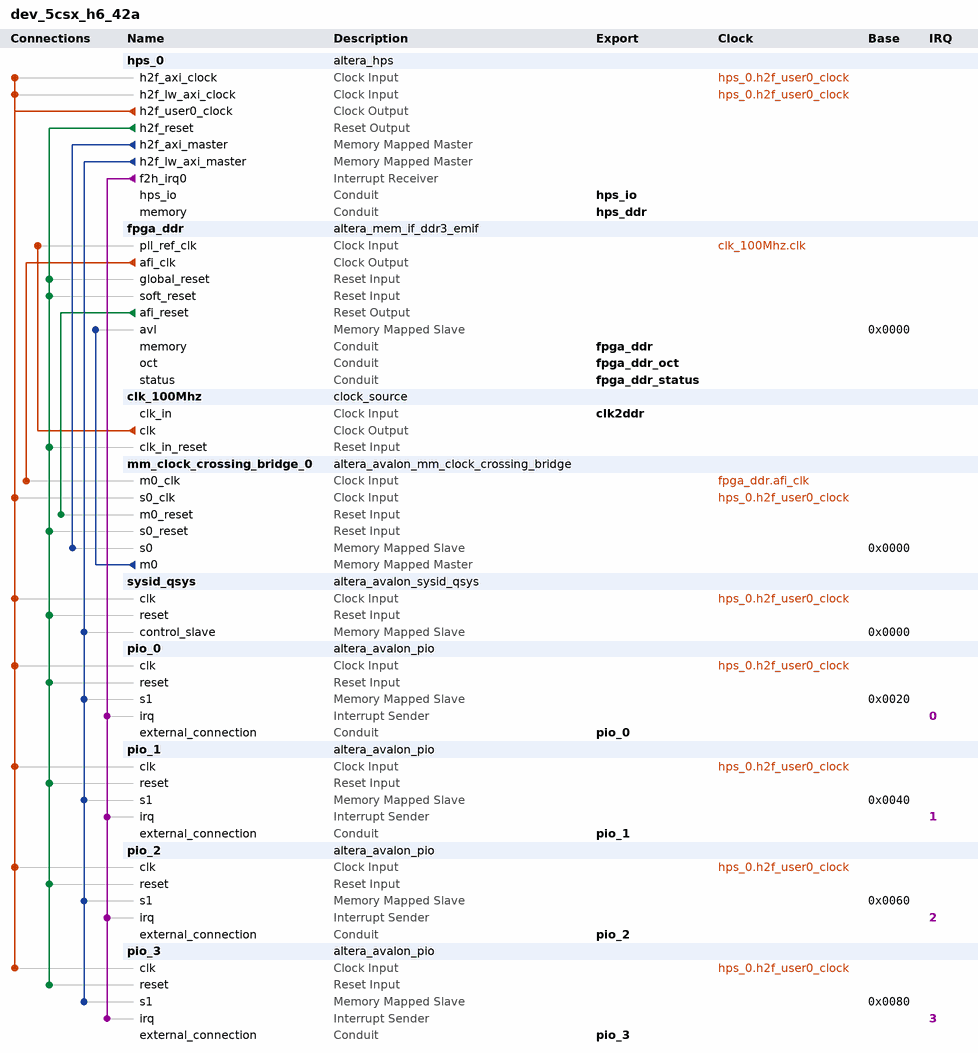
[diagram p0: system contents]
# Platform Designer (Qsys) system dev_5csx_h6_42a, Cyclone V 5CSXFC6C6U23C7
# Parameters at their usual value, and those the tool derives, are not listed.
package require -exact qsys 14.1
create_system dev_5csx_h6_42a
set_project_property DEVICE_FAMILY {Cyclone V}
set_project_property DEVICE 5CSXFC6C6U23C7

add_instance hps_0 altera_hps 14.1
set_instance_parameter_value hps_0 CAN0_Mode CAN
set_instance_parameter_value hps_0 CAN0_PinMuxing {HPS I/O Set 0}
set_instance_parameter_value hps_0 CAN1_Mode CAN
set_instance_parameter_value hps_0 CAN1_PinMuxing {HPS I/O Set 1}
set_instance_parameter_value hps_0 EMAC1_Mode RGMII
set_instance_parameter_value hps_0 EMAC1_PinMuxing {HPS I/O Set 0}
set_instance_parameter_value hps_0 F2SCLK_COLDRST_Enable false
set_instance_parameter_value hps_0 F2SCLK_DBGRST_Enable false
set_instance_parameter_value hps_0 F2SCLK_WARMRST_Enable false
set_instance_parameter_value hps_0 F2SINTERRUPT_Enable true
set_instance_parameter_value hps_0 F2S_Width 0
set_instance_parameter_value hps_0 FPGA_PERIPHERAL_OUTPUT_CLOCK_FREQ_EMAC0_GTX_CLK 100
set_instance_parameter_value hps_0 FPGA_PERIPHERAL_OUTPUT_CLOCK_FREQ_EMAC0_MD_CLK 100
set_instance_parameter_value hps_0 FPGA_PERIPHERAL_OUTPUT_CLOCK_FREQ_EMAC1_GTX_CLK 100
set_instance_parameter_value hps_0 FPGA_PERIPHERAL_OUTPUT_CLOCK_FREQ_EMAC1_MD_CLK 100
set_instance_parameter_value hps_0 HPS_PROTOCOL DDR3
set_instance_parameter_value hps_0 I2C0_Mode I2C
set_instance_parameter_value hps_0 I2C0_PinMuxing {HPS I/O Set 1}
set_instance_parameter_value hps_0 I2C1_Mode I2C
set_instance_parameter_value hps_0 I2C1_PinMuxing {HPS I/O Set 0}
set_instance_parameter_value hps_0 LWH2F_Enable true
set_instance_parameter_value hps_0 MEM_BANKADDR_WIDTH 3
set_instance_parameter_value hps_0 MEM_CLK_FREQ 400.0
set_instance_parameter_value hps_0 MEM_COL_ADDR_WIDTH 10
set_instance_parameter_value hps_0 MEM_DQ_WIDTH 40
set_instance_parameter_value hps_0 MEM_DRV_STR RZQ/7
set_instance_parameter_value hps_0 MEM_ROW_ADDR_WIDTH 15
set_instance_parameter_value hps_0 MEM_RTT_NOM RZQ/4
set_instance_parameter_value hps_0 MEM_RTT_WR {Dynamic ODT off}
set_instance_parameter_value hps_0 MEM_TCL 7
set_instance_parameter_value hps_0 MEM_TFAW_NS 30.0
set_instance_parameter_value hps_0 MEM_TRAS_NS 35.0
set_instance_parameter_value hps_0 MEM_TRCD_NS 13.75
set_instance_parameter_value hps_0 MEM_TRFC_NS 260.0
set_instance_parameter_value hps_0 MEM_TRP_NS 13.75
set_instance_parameter_value hps_0 MEM_TRRD_NS 10.0
set_instance_parameter_value hps_0 MEM_TRTP_NS 10.0
set_instance_parameter_value hps_0 MEM_VENDOR JEDEC
set_instance_parameter_value hps_0 MEM_VOLTAGE {1.35V DDR3L}
set_instance_parameter_value hps_0 MEM_WTCL 6
set_instance_parameter_value hps_0 QSPI_Mode {2 SS}
set_instance_parameter_value hps_0 QSPI_PinMuxing {HPS I/O Set 1}
set_instance_parameter_value hps_0 REF_CLK_FREQ 25.0
set_instance_parameter_value hps_0 S2FCLK_USER0CLK_Enable true
set_instance_parameter_value hps_0 S2F_Width 1
set_instance_parameter_value hps_0 SDIO_Mode {4-bit Data}
set_instance_parameter_value hps_0 SDIO_PinMuxing {HPS I/O Set 0}
set_instance_parameter_value hps_0 SPIM1_Mode N/A
set_instance_parameter_value hps_0 SPIM1_PinMuxing Unused
set_instance_parameter_value hps_0 STM_Enable false
set_instance_parameter_value hps_0 TIMING_BOARD_AC_SKEW 0.0
set_instance_parameter_value hps_0 TIMING_BOARD_AC_TO_CK_SKEW 0.0
set_instance_parameter_value hps_0 TIMING_BOARD_DQ_TO_DQS_SKEW 0.0
set_instance_parameter_value hps_0 TIMING_BOARD_MAX_CK_DELAY 0.6
set_instance_parameter_value hps_0 TIMING_BOARD_MAX_DQS_DELAY 0.2
set_instance_parameter_value hps_0 TIMING_BOARD_SKEW_BETWEEN_DQS 0.01
set_instance_parameter_value hps_0 TIMING_BOARD_SKEW_CKDQS_DIMM_MAX 0.215
set_instance_parameter_value hps_0 TIMING_BOARD_SKEW_CKDQS_DIMM_MIN 0.092
set_instance_parameter_value hps_0 TIMING_BOARD_SKEW_WITHIN_DQS 0.0
set_instance_parameter_value hps_0 TIMING_TDH 45
set_instance_parameter_value hps_0 TIMING_TDQSCK 225
set_instance_parameter_value hps_0 TIMING_TDQSQ 100
set_instance_parameter_value hps_0 TIMING_TDQSS 0.27
set_instance_parameter_value hps_0 TIMING_TDS 10
set_instance_parameter_value hps_0 TIMING_TDSH 0.18
set_instance_parameter_value hps_0 TIMING_TDSS 0.18
set_instance_parameter_value hps_0 TIMING_TIH 120
set_instance_parameter_value hps_0 TIMING_TIS 170
set_instance_parameter_value hps_0 TIMING_TQSH 0.4
set_instance_parameter_value hps_0 UART0_Mode {No Flow Control}
set_instance_parameter_value hps_0 UART0_PinMuxing {HPS I/O Set 2}
set_instance_parameter_value hps_0 USB1_Mode SDR
set_instance_parameter_value hps_0 USB1_PinMuxing {HPS I/O Set 0}
set_instance_parameter_value hps_0 desired_cfg_clk_mhz 100.0
set_instance_parameter_value hps_0 desired_qspi_clk_mhz 400.0

add_instance fpga_ddr altera_mem_if_ddr3_emif 14.1
set_instance_parameter_value fpga_ddr AVL_MAX_SIZE 4
set_instance_parameter_value fpga_ddr BYTE_ENABLE false
set_instance_parameter_value fpga_ddr CALIBRATION_MODE Skip
set_instance_parameter_value fpga_ddr CORE_DEBUG_CONNECTION INTERNAL_JTAG
set_instance_parameter_value fpga_ddr CPORT_TYPE_PORT Bidirectional,Bidirectional,Bidirectional,Bidirectional,Bidirectional,Bidirectional
set_instance_parameter_value fpga_ddr EXPORT_AFI_HALF_CLK false
set_instance_parameter_value fpga_ddr HARD_EMIF false
set_instance_parameter_value fpga_ddr MEM_BANKADDR_WIDTH 3
set_instance_parameter_value fpga_ddr MEM_CLK_FREQ 300.0
set_instance_parameter_value fpga_ddr MEM_CLK_FREQ_MAX 800.0
set_instance_parameter_value fpga_ddr MEM_COL_ADDR_WIDTH 10
set_instance_parameter_value fpga_ddr MEM_DQ_WIDTH 8
set_instance_parameter_value fpga_ddr MEM_DRV_STR RZQ/6
set_instance_parameter_value fpga_ddr MEM_FORMAT DISCRETE
set_instance_parameter_value fpga_ddr MEM_ROW_ADDR_WIDTH 15
set_instance_parameter_value fpga_ddr MEM_RTT_NOM {ODT Disabled}
set_instance_parameter_value fpga_ddr MEM_TCL 7
set_instance_parameter_value fpga_ddr MEM_TFAW_NS 30.0
set_instance_parameter_value fpga_ddr MEM_TRAS_NS 35.0
set_instance_parameter_value fpga_ddr MEM_TRCD_NS 13.75
set_instance_parameter_value fpga_ddr MEM_TRFC_NS 260.0
set_instance_parameter_value fpga_ddr MEM_TRP_NS 13.75
set_instance_parameter_value fpga_ddr MEM_TRRD_NS 10.0
set_instance_parameter_value fpga_ddr MEM_TRTP_NS 10.0
set_instance_parameter_value fpga_ddr MEM_TWTR 4
set_instance_parameter_value fpga_ddr MEM_VENDOR JEDEC
set_instance_parameter_value fpga_ddr MEM_VOLTAGE {1.35V DDR3L}
set_instance_parameter_value fpga_ddr MEM_WTCL 6
set_instance_parameter_value fpga_ddr PLL_LOCATION Top_Bottom
set_instance_parameter_value fpga_ddr POWER_OF_TWO_BUS false
set_instance_parameter_value fpga_ddr PRIORITY_PORT 1,1,1,1,1,1
set_instance_parameter_value fpga_ddr RATE Half
set_instance_parameter_value fpga_ddr REF_CLK_FREQ 100.0
set_instance_parameter_value fpga_ddr SPEED_GRADE 7
set_instance_parameter_value fpga_ddr TIMING_BOARD_AC_SKEW 0.0186
set_instance_parameter_value fpga_ddr TIMING_BOARD_AC_TO_CK_SKEW -0.02
set_instance_parameter_value fpga_ddr TIMING_BOARD_DQ_TO_DQS_SKEW 0.001
set_instance_parameter_value fpga_ddr TIMING_BOARD_MAX_CK_DELAY 0.237
set_instance_parameter_value fpga_ddr TIMING_BOARD_MAX_DQS_DELAY 0.071
set_instance_parameter_value fpga_ddr TIMING_BOARD_SKEW_BETWEEN_DQS 0.001
set_instance_parameter_value fpga_ddr TIMING_BOARD_SKEW_CKDQS_DIMM_MAX 0.167
set_instance_parameter_value fpga_ddr TIMING_BOARD_SKEW_CKDQS_DIMM_MIN 0.167
set_instance_parameter_value fpga_ddr TIMING_BOARD_SKEW_WITHIN_DQS 0.001
set_instance_parameter_value fpga_ddr TIMING_TDH 45
set_instance_parameter_value fpga_ddr TIMING_TDQSCK 255
set_instance_parameter_value fpga_ddr TIMING_TDQSQ 100
set_instance_parameter_value fpga_ddr TIMING_TDQSS 0.27
set_instance_parameter_value fpga_ddr TIMING_TDS 10
set_instance_parameter_value fpga_ddr TIMING_TDSH 0.18
set_instance_parameter_value fpga_ddr TIMING_TDSS 0.18
set_instance_parameter_value fpga_ddr TIMING_TIH 120
set_instance_parameter_value fpga_ddr TIMING_TIS 170
set_instance_parameter_value fpga_ddr TIMING_TQSH 0.4
set_instance_parameter_value fpga_ddr USER_DEBUG_LEVEL 1

add_instance clk_100Mhz clock_source 14.1
set_instance_parameter_value clk_100Mhz clockFrequency 100000000

add_instance mm_clock_crossing_bridge_0 altera_avalon_mm_clock_crossing_bridge 14.1
set_instance_parameter_value mm_clock_crossing_bridge_0 ADDRESS_WIDTH 28
set_instance_parameter_value mm_clock_crossing_bridge_0 COMMAND_FIFO_DEPTH 512
set_instance_parameter_value mm_clock_crossing_bridge_0 DATA_WIDTH 32
set_instance_parameter_value mm_clock_crossing_bridge_0 MASTER_SYNC_DEPTH 4
set_instance_parameter_value mm_clock_crossing_bridge_0 MAX_BURST_SIZE 1
set_instance_parameter_value mm_clock_crossing_bridge_0 RESPONSE_FIFO_DEPTH 512
set_instance_parameter_value mm_clock_crossing_bridge_0 SLAVE_SYNC_DEPTH 4
set_instance_parameter_value mm_clock_crossing_bridge_0 USE_AUTO_ADDRESS_WIDTH 0

add_instance sysid_qsys altera_avalon_sysid_qsys 14.1
set_instance_parameter_value sysid_qsys id 1

add_instance pio_0 altera_avalon_pio 14.1
set_instance_parameter_value pio_0 bitClearingEdgeCapReg true
set_instance_parameter_value pio_0 bitModifyingOutReg true
set_instance_parameter_value pio_0 captureEdge true
set_instance_parameter_value pio_0 direction Bidir
set_instance_parameter_value pio_0 generateIRQ true
set_instance_parameter_value pio_0 irqType EDGE
set_instance_parameter_value pio_0 width 32

add_instance pio_1 altera_avalon_pio 14.1
set_instance_parameter_value pio_1 bitClearingEdgeCapReg true
set_instance_parameter_value pio_1 bitModifyingOutReg true
set_instance_parameter_value pio_1 captureEdge true
set_instance_parameter_value pio_1 direction Bidir
set_instance_parameter_value pio_1 generateIRQ true
set_instance_parameter_value pio_1 irqType EDGE
set_instance_parameter_value pio_1 width 32

add_instance pio_2 altera_avalon_pio 14.1
set_instance_parameter_value pio_2 bitClearingEdgeCapReg true
set_instance_parameter_value pio_2 bitModifyingOutReg true
set_instance_parameter_value pio_2 captureEdge true
set_instance_parameter_value pio_2 direction Bidir
set_instance_parameter_value pio_2 generateIRQ true
set_instance_parameter_value pio_2 irqType EDGE
set_instance_parameter_value pio_2 width 32

add_instance pio_3 altera_avalon_pio 14.1
set_instance_parameter_value pio_3 bitClearingEdgeCapReg true
set_instance_parameter_value pio_3 bitModifyingOutReg true
set_instance_parameter_value pio_3 captureEdge true
set_instance_parameter_value pio_3 direction Bidir
set_instance_parameter_value pio_3 generateIRQ true
set_instance_parameter_value pio_3 irqType EDGE
set_instance_parameter_value pio_3 width 3

# connections
add_connection clk_100Mhz.clk fpga_ddr.pll_ref_clk clock
add_connection fpga_ddr.afi_clk mm_clock_crossing_bridge_0.m0_clk clock
add_connection hps_0.h2f_user0_clock hps_0.h2f_axi_clock clock
add_connection hps_0.h2f_user0_clock hps_0.h2f_lw_axi_clock clock
add_connection hps_0.h2f_user0_clock mm_clock_crossing_bridge_0.s0_clk clock
add_connection hps_0.h2f_user0_clock pio_0.clk clock
add_connection hps_0.h2f_user0_clock pio_1.clk clock
add_connection hps_0.h2f_user0_clock pio_2.clk clock
add_connection hps_0.h2f_user0_clock pio_3.clk clock
add_connection hps_0.h2f_user0_clock sysid_qsys.clk clock
add_connection fpga_ddr.afi_reset mm_clock_crossing_bridge_0.m0_reset reset
add_connection hps_0.h2f_reset clk_100Mhz.clk_in_reset reset
add_connection hps_0.h2f_reset fpga_ddr.global_reset reset
add_connection hps_0.h2f_reset fpga_ddr.soft_reset reset
add_connection hps_0.h2f_reset mm_clock_crossing_bridge_0.s0_reset reset
add_connection hps_0.h2f_reset pio_0.reset reset
add_connection hps_0.h2f_reset pio_1.reset reset
add_connection hps_0.h2f_reset pio_2.reset reset
add_connection hps_0.h2f_reset pio_3.reset reset
add_connection hps_0.h2f_reset sysid_qsys.reset reset
add_connection hps_0.h2f_axi_master mm_clock_crossing_bridge_0.s0 avalon
set_connection_parameter_value hps_0.h2f_axi_master/mm_clock_crossing_bridge_0.s0 baseAddress 0x0000
add_connection hps_0.h2f_lw_axi_master pio_0.s1 avalon
set_connection_parameter_value hps_0.h2f_lw_axi_master/pio_0.s1 baseAddress 0x0020
add_connection hps_0.h2f_lw_axi_master pio_1.s1 avalon
set_connection_parameter_value hps_0.h2f_lw_axi_master/pio_1.s1 baseAddress 0x0040
add_connection hps_0.h2f_lw_axi_master pio_2.s1 avalon
set_connection_parameter_value hps_0.h2f_lw_axi_master/pio_2.s1 baseAddress 0x0060
add_connection hps_0.h2f_lw_axi_master pio_3.s1 avalon
set_connection_parameter_value hps_0.h2f_lw_axi_master/pio_3.s1 baseAddress 0x0080
add_connection hps_0.h2f_lw_axi_master sysid_qsys.control_slave avalon
set_connection_parameter_value hps_0.h2f_lw_axi_master/sysid_qsys.control_slave baseAddress 0x0000
add_connection mm_clock_crossing_bridge_0.m0 fpga_ddr.avl avalon
set_connection_parameter_value mm_clock_crossing_bridge_0.m0/fpga_ddr.avl baseAddress 0x0000
add_connection hps_0.f2h_irq0 pio_0.irq interrupt
set_connection_parameter_value hps_0.f2h_irq0/pio_0.irq irqNumber 0
add_connection hps_0.f2h_irq0 pio_1.irq interrupt
set_connection_parameter_value hps_0.f2h_irq0/pio_1.irq irqNumber 1
add_connection hps_0.f2h_irq0 pio_2.irq interrupt
set_connection_parameter_value hps_0.f2h_irq0/pio_2.irq irqNumber 2
add_connection hps_0.f2h_irq0 pio_3.irq interrupt
set_connection_parameter_value hps_0.f2h_irq0/pio_3.irq irqNumber 3

# exported interfaces
add_interface clk2ddr clock sink
set_interface_property clk2ddr EXPORT_OF clk_100Mhz.clk_in
add_interface fpga_ddr conduit end
set_interface_property fpga_ddr EXPORT_OF fpga_ddr.memory
add_interface fpga_ddr_oct conduit end
set_interface_property fpga_ddr_oct EXPORT_OF fpga_ddr.oct
add_interface fpga_ddr_status conduit end
set_interface_property fpga_ddr_status EXPORT_OF fpga_ddr.status
add_interface hps_ddr conduit end
set_interface_property hps_ddr EXPORT_OF hps_0.memory
add_interface hps_io conduit end
set_interface_property hps_io EXPORT_OF hps_0.hps_io
add_interface pio_0 conduit end
set_interface_property pio_0 EXPORT_OF pio_0.external_connection
add_interface pio_1 conduit end
set_interface_property pio_1 EXPORT_OF pio_1.external_connection
add_interface pio_2 conduit end
set_interface_property pio_2 EXPORT_OF pio_2.external_connection
add_interface pio_3 conduit end
set_interface_property pio_3 EXPORT_OF pio_3.external_connection

set_interconnect_requirement {$system} qsys_mm.clockCrossingAdapter HANDSHAKE
set_interconnect_requirement {$system} qsys_mm.maxAdditionalLatency 4

save_system dev_5csx_h6_42a.qsys
